# EAGLE design R650BS1B (EAGLE 6.6.0)
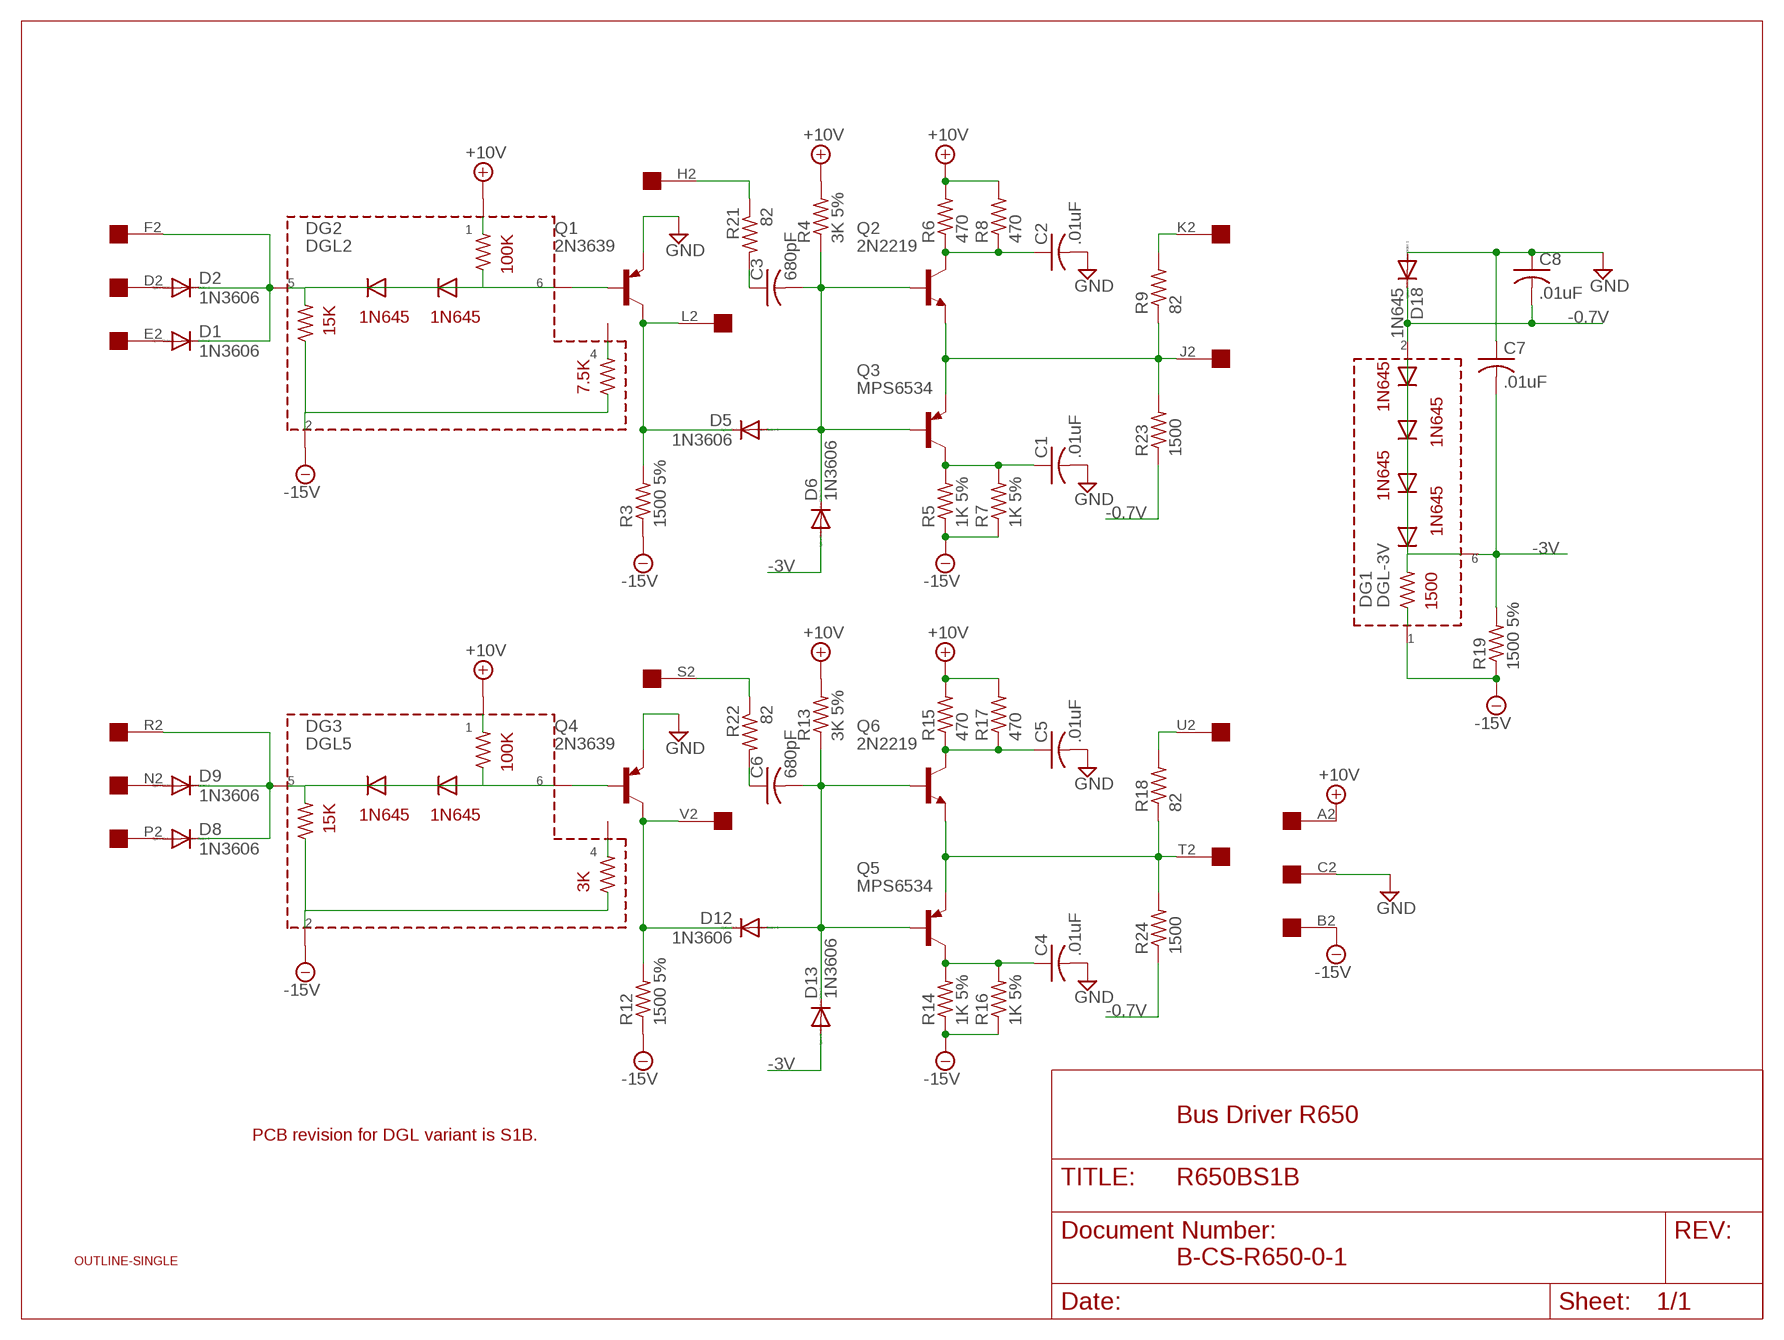
[diagram p0: schematic, sheet 1]

## Parts
C1  .01uF  C-US102-043X133  [C102-043X133]
C2  .01uF  C-US102-043X133  [C102-043X133]
C3  680pF  C-US102-043X133  [C102-043X133]
C4  .01uF  C-US102-043X133  [C102-043X133]
C5  .01uF  C-US102-043X133  [C102-043X133]
C6  680pF  C-US102-043X133  [C102-043X133]
C7  .01uF  C-US102-043X133  [C102-043X133]
C8  .01uF  C-US102-043X133  [C102-043X133]
D1  1N3606  1N4148DO35-10  [DO35-10]
D2  1N3606  1N4148DO35-10  [DO35-10]
D5  1N3606  1N4148DO35-10  [DO35-10]
D6  1N3606  1N4148DO35-10  [DO35-10]
D8  1N3606  1N4148DO35-10  [DO35-10]
D9  1N3606  1N4148DO35-10  [DO35-10]
D12  1N3606  1N4148DO35-10  [DO35-10]
D13  1N3606  1N4148DO35-10  [DO35-10]
D18  1N645  1N4148DO35-10  [DO35-10]
DG1  DGL-3V  [DGL2]
DG2  DGL2  [DGL2]
DG3  DGL5  [DGL2]
Q1  2N3639  2N3637  [TO39]
Q2  2N2219  [TO5]
Q3  MPS6534  2N3637  [TO39]
Q4  2N3639  2N3637  [TO39]
Q5  MPS6534  2N3637  [TO39]
Q6  2N2219  [TO5]
R3  1500 5%  R-US_0207/10  [0207/10]
R4  3K 5%  R-US_0207/10  [0207/10]
R5  1K 5%  R-US_0207/10  [0207/10]
R6  470  R-US_0207/10  [0207/10]
R7  1K 5%  R-US_0207/10  [0207/10]
R8  470  R-US_0207/10  [0207/10]
R9  82  R-US_0207/10  [0207/10]
R12  1500 5%  R-US_0207/10  [0207/10]
R13  3K 5%  R-US_0207/10  [0207/10]
R14  1K 5%  R-US_0207/10  [0207/10]
R15  470  R-US_0207/10  [0207/10]
R16  1K 5%  R-US_0207/10  [0207/10]
R17  470  R-US_0207/10  [0207/10]
R18  82  R-US_0207/10  [0207/10]
R19  1500 5%  R-US_0207/10  [0207/10]
R21  82  R-US_0207/10  [0207/10]
R22  82  R-US_0207/10  [0207/10]
R23  1500  R-US_0207/10  [0207/10]
R24  1500  R-US_0207/10  [0207/10]
U$1  OUTLINE-SINGLE  [SINGLE]
U$2  EDGE-1  [EDGE-CON1]

## Nets
+10V [Power]: DG2.P$1 DG3.P$1 R4.2 R6.2 R8.2 R13.2 R15.2 R17.2 U$2.A2
-0.7V [Power]: C8.2 D18.C DG1.P$2 R23.1 R24.1
-3V [Power]: C7.2 D6.A D13.A DG1.P$6 R19.2
-15V [Power]: DG1.P$1 DG2.P$2 DG3.P$2 R3.1 R5.1 R7.1 R12.1 R14.1 R16.1 R19.1 U$2.B2
GND [Power]: C1.2 C2.2 C4.2 C5.2 C7.1 C8.1 D18.A Q1.1(E) Q4.1(E) U$2.C2
N$1: C3.2 D5.A D6.C Q2.2(B) Q3.2(B) R4.1
N$2: Q2.1(E) Q3.1(E) R9.1 R23.2 U$2.J2
N$3: R9.2 U$2.K2
N$4: D12.C Q4.3(C) R12.2 U$2.V2
N$5: D5.C Q1.3(C) R3.2 U$2.L2
N$6: C2.1 Q2.3(C) R6.1 R8.1
N$7: C1.1 Q3.3(C) R5.2 R7.2
N$8: DG2.P$6 Q1.2(B)
N$9: DG3.P$6 Q4.2(B)
N$10: D8.C D9.C DG3.P$5 U$2.R2
N$14: R21.1 U$2.H2
N$15: C3.1 R21.2
N$17: C6.2 D12.A D13.C Q5.2(B) Q6.2(B) R13.1
N$18: Q5.1(E) Q6.1(E) R18.1 R24.2 U$2.T2
N$21: D1.A U$2.E2
N$22: D1.C D2.C DG2.P$5 U$2.F2
N$25: C5.1 Q6.3(C) R15.1 R17.1
N$26: C4.1 Q5.3(C) R14.2 R16.2
N$27: R18.2 U$2.U2
N$28: R22.1 U$2.S2
N$29: C6.1 R22.2
N$30: D9.A U$2.N2
N$31: D8.A U$2.P2
N$39: D2.A U$2.D2
Unconnected: DG2.P$4 DG3.P$4 U$2.M2

## Notes on the sheet
- Bus Driver R650
- PCB revision for DGL variant is S1B.
- B-CS-R650-0-1

## Library data of the parts
C1-C8 = rcl:C-US: CAPACITOR, American symbol
D1 D2 D5 D6 D8 D9 D12 D13 D18 = diode:1N4148: DIODE high speed (Philips)
DG1 = dec-con:DGL-3V: -3V Clamp/Reference
DG2 = dec-con:DGL2: Diode Gate Logic Block
DG3 = dec-con:DGL5: Like DGL2, but for Sxxx modules, not Rxxx.
Q1 Q3-Q5 = transistor-pnp:2N3637*: PNP Transistror
Q2 Q6 = transistor:2N2219: NPN TRANSISTOR
R3-R9 R12-R19 R21-R24 = rcl:R-US_: RESISTOR, American symbol
U$1 = dec-con:OUTLINE-*: Board outlines for DEC boards.
U$2 = dec-con:EDGE-1: Single-Sided DEC Edge Connector -- (side 2)

## Net classes
1 Power: width 0.813 mm

## Board
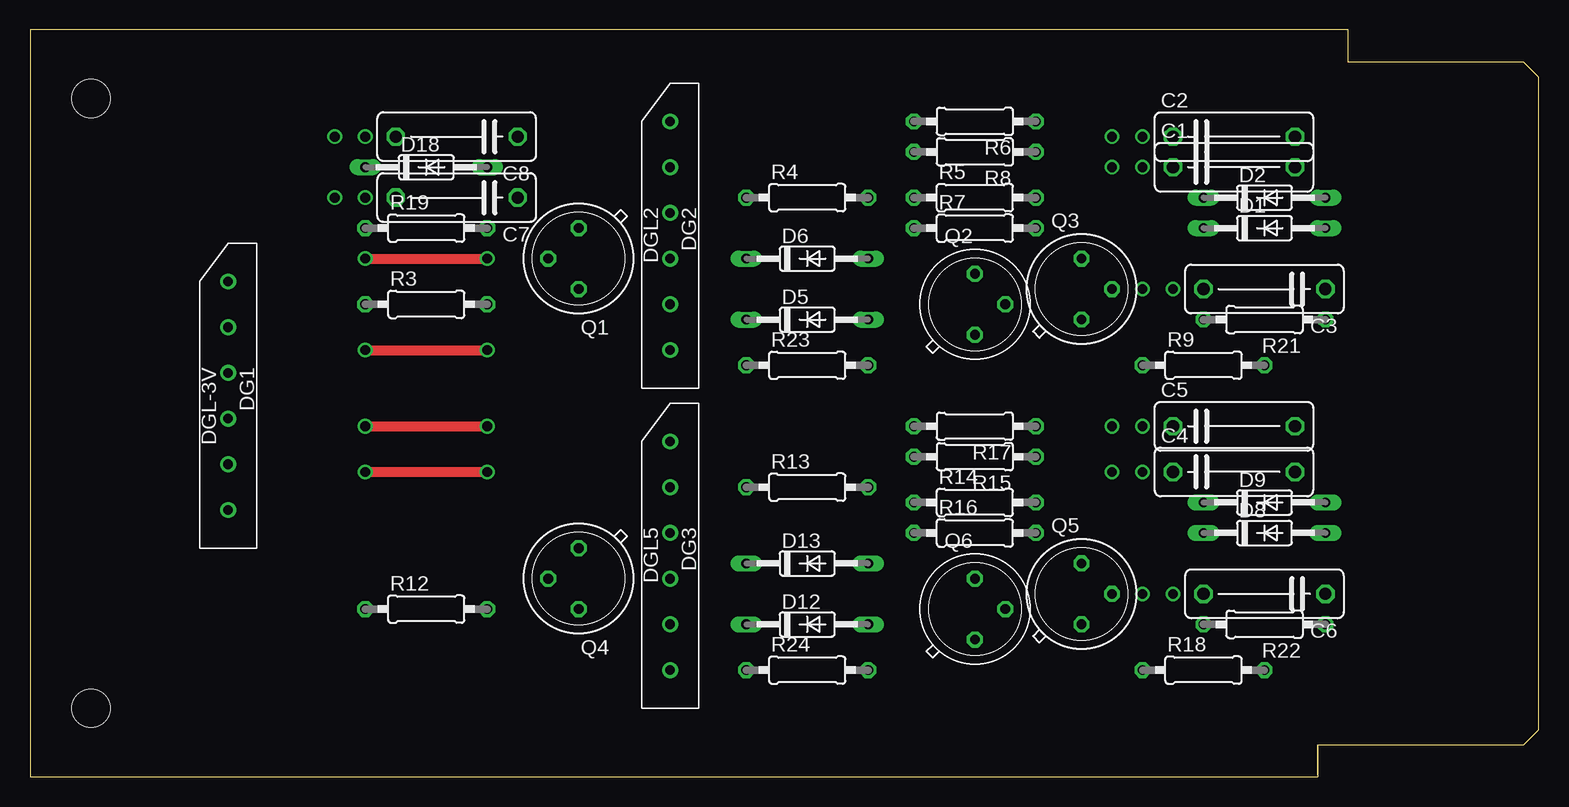
[diagram p1: board, top side]
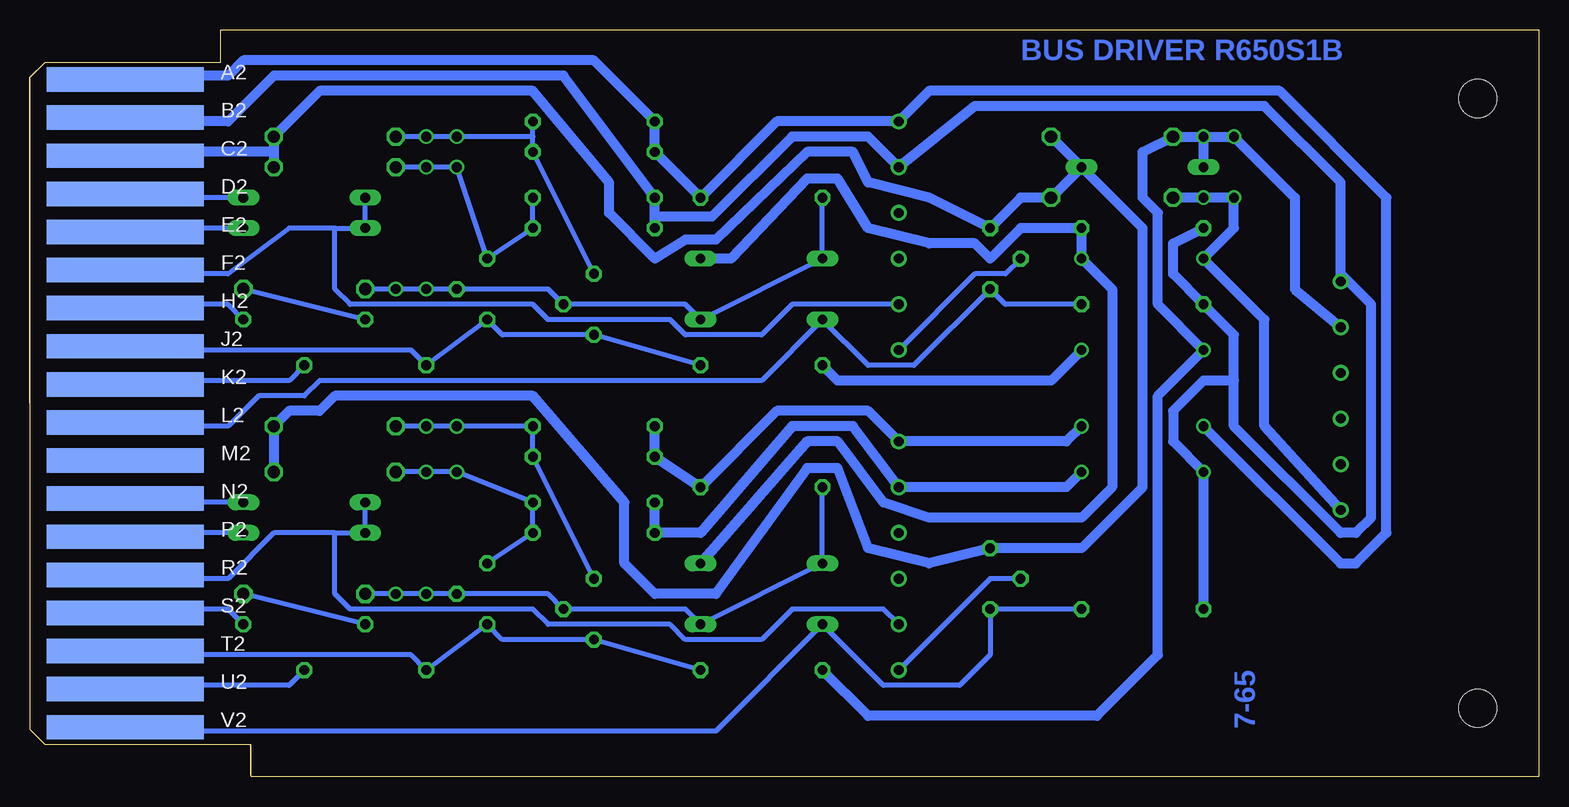
[diagram p2: board, bottom side, seen from below]

Size 125.73 x 62.23 mm. Coordinates in mm from the lower left corner, seen from the top.
Copper layers (1+16): Top 0.035mm / dielectric 1.5mm / Bottom 0.035mm
Design rules "16mils": minimum track width 16mil, minimum drill 32mil, track to track 15mil, track to pad 10mil, pad to pad 10mil, via to via 10mil, smd to smd 10mil, copper to edge 13mil, drill to drill 10mil, minimum pad ring 10mil, minimum via ring 8mil, stop-mask expansion 0mil, vias tented up to drill 0mil, thermal gap 10mil

### Footprints (pad centres in the part's own frame; a part is rotated, then mirrored left to right if it is on the bottom)
C102-043X133 = drill 1.016 octagon: 1 -5.08,0; 2 5.08,0
DO35-10 = drill 0.813 long: A 5.08,0; C -5.08,0
DGL2 = drill 0.813: P$1 -9.525,0; P$2 -5.715,0; P$3 -1.905,0; P$4 1.905,0; P$5 5.715,0; P$6 9.525,0
TO39 = drill 0.813 octagon: 1 0,-2.54; 2 2.54,0; 3 0,2.54
TO5 = drill 0.813 octagon: 1 0,-2.54; 2 2.54,0; 3 0,2.54
0207/10 = drill 0.813 octagon: 1 -5.08,0; 2 5.08,0
SINGLE = hole 3.175: 120.65,56.515; 120.65,5.715
EDGE-CON1 = smd 13.106 x 2.032 bottom: A2 7.938,4.128; B2 7.938,7.303; C2 7.938,10.477; D2 7.938,13.652; E2 7.938,16.828; F2 7.938,20.003; H2 7.938,23.177; J2 7.938,26.352; K2 7.938,29.527; L2 7.938,32.703; M2 7.938,35.877; N2 7.938,39.053; P2 7.938,42.227; R2 7.938,45.403; S2 7.938,48.578; T2 7.938,51.752; U2 7.938,54.928; V2 7.938,58.102

### Placement (x,y rotation side)
C1  100.33,50.8 0 top
C2  100.33,53.34 0 top
C3  102.87,40.64 180 top
C4  100.33,25.4 0 top
C5  100.33,29.21 0 top
C6  102.87,15.24 180 top
C7  35.56,48.26 180 top
C8  35.56,53.34 180 top
D1  102.87,45.72 0 top
D2  102.87,48.26 0 top
D5  64.77,38.1 0 top
D6  64.77,43.18 0 top
D8  102.87,20.32 0 top
D9  102.87,22.86 0 top
D12  64.77,12.7 0 top
D13  64.77,17.78 0 top
D18  33.02,50.8 0 top
DG1  16.51,31.75 270 top
DG2  53.34,45.09 270 top
DG3  53.34,18.41 270 top
Q1  45.72,43.18 180 top
Q2  78.74,39.37 0 top
Q3  87.63,40.64 0 top
Q4  45.72,16.51 180 top
Q5  87.63,15.24 0 top
Q6  78.74,13.97 0 top
R3  33.02,39.37 0 top
R4  64.77,48.26 0 top
R5  78.74,48.26 0 top
R6  78.74,54.61 180 top
R7  78.74,45.72 0 top
R8  78.74,52.07 180 top
R9  97.79,34.29 0 top
R12  33.02,13.97 0 top
R13  64.77,24.13 0 top
R14  78.74,22.86 0 top
R15  78.74,26.67 180 top
R16  78.74,20.32 0 top
R17  78.74,29.21 180 top
R18  97.79,8.89 0 top
R19  33.02,45.72 0 top
R21  102.87,38.1 180 top
R22  102.87,12.7 180 top
R23  64.77,34.29 0 top
R24  64.77,8.89 0 top
U$1  125.73,62.23 180 top
U$2  125.73,62.23 180 top

### Tracks (layer width: path | path; a pad name or v marks a point on that pad's centre or on a via)
+10V  (via drill 0.81)
  Top 0.813: v27.94,29.21 v38.1,29.21
  Bottom 0.813: U$2.A2 116.84,58.42 109.22,58.42 107.95,59.69 78.74,59.69 R6.2 R8.2 R4.2 63.5,54.61 DG2.P$1 50.8,57.15 21.59,57.15 12.7,48.26 12.7,20.32 15.24,17.78 16.51,17.78 v27.94,29.21 | R17.2 R15.2 R13.2 63.5,30.48 55.88,30.48 DG3.P$1 39.37,27.94 v38.1,29.21
-0.7V  (via drill 0.81)
  Top 0.813: v27.94,35.56 v38.1,35.56
  Bottom 0.813: v27.94,53.34 C8.2 33.02,52.07 33.02,48.26 31.75,46.99 31.75,39.37 v27.94,35.56 31.75,31.75 31.75,10.16 36.83,5.08 55.88,5.08 R24.1 | v27.94,53.34 v25.4,53.34 | v27.94,53.34 v25.4,53.34 | v27.94,53.34 D18.C | DG1.P$2 20.32,40.64 20.32,48.26 v25.4,53.34 | R23.1 58.42,33.02 40.64,33.02 v38.1,35.56
-3V  (via drill 0.81)
  Top 0.813: v27.94,43.18 v38.1,43.18
  Bottom 0.813: D6.A 67.31,43.18 60.96,49.85 58.42,49.85 55.88,45.72 50.8,44.45 46.99,44.45 45.72,43.18 43.18,45.72 R19.2 v38.1,43.18 35.56,40.64 35.56,24.13 38.1,21.59 50.8,21.59 54.61,22.86 58.42,27.94 60.96,27.94 D13.A | C7.2 v27.94,48.26 v25.4,48.26 25.4,45.72 v27.94,43.18 22.86,38.1 22.86,29.21 DG1.P$6
-15V  (via drill 0.81)
  Top 0.813: v27.94,25.4 v38.1,25.4
  Bottom 0.813: U$2.B2 116.84,54.61 109.22,54.61 105.41,58.42 81.28,58.42 R5.1 R7.1 73.66,46.67 68.9,46.67 62.23,53.34 55.88,53.34 DG2.P$2 46.99,55.88 22.86,55.88 16.51,49.53 16.51,41.91 | R14.1 R16.1 69.85,20.32 62.23,29.21 57.15,29.21 DG3.P$2 39.37,24.13 v38.1,25.4 | 16.51,41.91 DG1.P$1 | 16.51,41.91 13.97,39.37 13.97,21.59 15.24,20.32 16.51,20.32 25.4,29.21 25.4,33.02 | 25.4,33.02 25.4,36.83 R3.1 30.48,41.91 30.48,44.45 R19.1 | 25.4,33.02 27.94,33.02 30.48,30.48 30.48,27.94 v27.94,25.4 R12.1
GND
  Bottom 0.813: U$2.C2 116.84,52.07 105.41,52.07 | 105.41,52.07 C1.2 | 105.41,52.07 C2.2 101.6,57.15 83.82,57.15 77.47,49.53 77.47,46.99 73.66,43.18 71.12,44.77 68.58,44.77 60.96,52.07 57.15,52.07 55.88,49.53 50.8,48.26 Q1.1 43.18,48.26 C7.1 D18.A | C4.2 C5.2 104.14,30.48 101.6,30.48 100.33,31.75 83.82,31.75 76.2,22.86 76.2,17.78 73.66,15.24 68.58,15.24 60.96,25.72 58.42,25.72 55.88,19.05 50.8,17.78 Q4.1 38.1,19.05 33.02,24.13 33.02,45.72 D18.A | D18.A C8.1
N$1  (via drill 0.81)
  Bottom 0.406: C3.2 v95.25,40.64 v92.71,40.64 Q3.2 82.55,40.64 Q2.2 71.12,39.37 D5.A D6.C R4.1
N$2
  Bottom 0.406: U$2.J2 116.84,35.56 93.98,35.56 R9.1 Q3.1 86.36,36.83 Q2.1 R23.2
N$3
  Bottom 0.406: U$2.K2 116.84,33.02 104.14,33.02 R9.2
N$4
  Bottom 0.406: U$2.V2 118.11,3.81 68.58,3.81 D12.C 54.61,7.62 48.26,7.62 45.72,10.16 Q4.3 R12.2
N$5
  Bottom 0.406: U$2.L2 116.84,29.21 109.22,29.21 106.68,31.75 102.87,31.75 101.6,33.02 64.77,33.02 D5.C 55.88,34.29 52.07,34.29 Q1.3 44.45,39.37 R3.2
N$6  (via drill 0.81)
  Bottom 0.406: 83.82,53.34 v90.17,53.34 v92.71,53.34 C2.1 | 83.82,53.34 R6.1 | 83.82,53.34 R8.1 Q2.3
N$7  (via drill 0.81)
  Bottom 0.406: C1.1 v92.71,50.8 v90.17,50.8 Q3.3 R7.2 R5.2
N$8
  Bottom 0.406: Q1.2 44.45,41.91 46.99,41.91 DG2.P$6
N$9
  Bottom 0.406: Q4.2 45.72,16.51 DG3.P$6
N$10
  Bottom 0.406: D9.C D8.C 100.33,20.32 | U$2.R2 116.84,16.51 109.22,16.51 105.41,20.32 100.33,20.32 | DG3.P$5 54.61,13.97 62.23,13.97 64.77,11.43 71.12,11.43 72.39,12.7 82.55,12.7 83.82,13.97 99.06,13.97 100.33,15.24 100.33,20.32
N$14
  Bottom 0.406: U$2.H2 116.84,39.37 109.22,39.37 R21.1
N$15
  Bottom 0.406: R21.2 C3.1
N$17  (via drill 0.81)
  Bottom 0.406: C6.2 v95.25,15.24 v92.71,15.24 Q5.2 82.55,15.24 Q6.2 71.12,13.97 D12.A D13.C R13.1
N$18
  Bottom 0.406: U$2.T2 117.17,10.49 116.84,10.16 93.98,10.16 R18.1 Q5.1 86.36,11.43 Q6.1 R24.2
N$21
  Bottom 0.406: U$2.E2 116.84,45.72 D1.A
N$22
  Bottom 0.406: D2.C D1.C 100.33,45.72 | U$2.F2 116.84,41.91 109.22,41.91 104.14,45.72 100.33,45.72 | DG2.P$5 62.23,39.37 64.77,36.83 71.12,36.83 72.39,38.1 82.55,38.1 83.82,39.37 99.06,39.37 100.33,40.64 100.33,45.72
N$25  (via drill 0.81)
  Bottom 0.406: C5.1 v92.71,29.21 v90.17,29.21 R17.1 R15.1 Q6.3
N$26  (via drill 0.81)
  Bottom 0.406: Q5.3 R16.2 R14.2 v90.17,25.4 v92.71,25.4 C4.1
N$27
  Bottom 0.406: U$2.U2 116.84,7.26 116.84,7.62 104.14,7.62 R18.2
N$28
  Bottom 0.406: U$2.S2 116.84,13.97 109.22,13.97 R22.1
N$29
  Bottom 0.406: R22.2 C6.1
N$30
  Bottom 0.406: U$2.N2 116.84,22.86 D9.A
N$31
  Bottom 0.406: U$2.P2 116.84,20.32 D8.A
N$39
  Bottom 0.406: U$2.D2 116.84,48.26 D2.A

### Text on the board
Bottom: BUS DRIVER R650S1B | 7-65